# EAGLE design untitled (EAGLE 8.7.0)
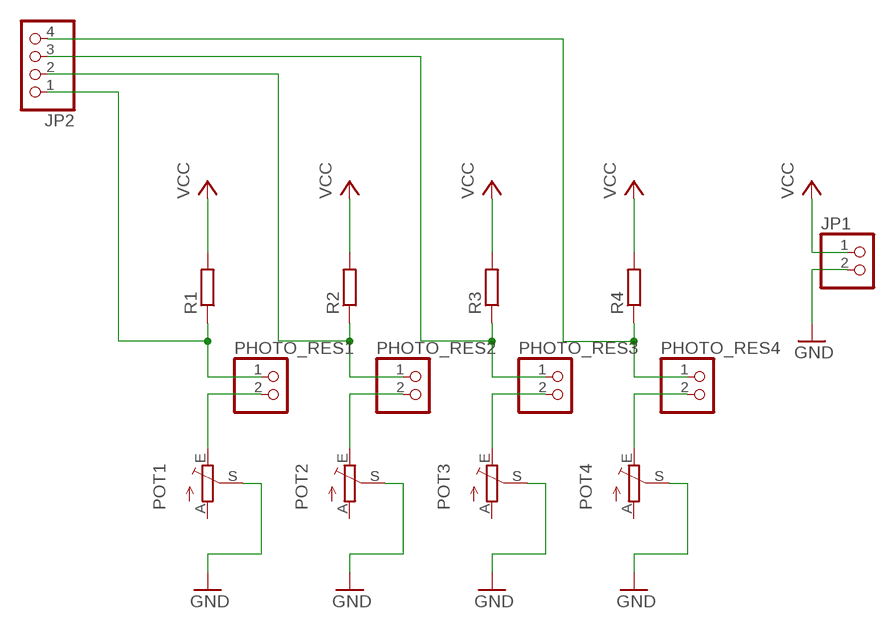
[diagram p0: schematic, sheet 1]

## Parts
JP1  PINHD-1X2  [1X02]
JP2  PINHD-1X4  [1X04]
PHOTO_RES1  PINHD-1X2  [1X02]
PHOTO_RES2  PINHD-1X2  [1X02]
PHOTO_RES3  PINHD-1X2  [1X02]
PHOTO_RES4  PINHD-1X2  [1X02]
POT1  TRIM_EU-RJ9W  [RJ9W]
POT2  TRIM_EU-RJ9W  [RJ9W]
POT3  TRIM_EU-RJ9W  [RJ9W]
POT4  TRIM_EU-RJ9W  [RJ9W]
R1  R-EU_0207/7  [0207/7]
R2  R-EU_0207/7  [0207/7]
R3  R-EU_0207/7  [0207/7]
R4  R-EU_0207/7  [0207/7]

## Nets
GND: JP1.2 POT1.S POT2.S POT3.S POT4.S
N$1: JP2.1 PHOTO_RES1.1 R1.1
N$2: PHOTO_RES1.2 POT1.E
N$3: JP2.2 PHOTO_RES2.1 R2.1
N$4: PHOTO_RES2.2 POT2.E
N$5: JP2.3 PHOTO_RES3.1 R3.1
N$6: PHOTO_RES3.2 POT3.E
N$7: JP2.4 PHOTO_RES4.1 R4.1
N$8: PHOTO_RES4.2 POT4.E
VCC: JP1.1 R1.2 R2.2 R3.2 R4.2
Unconnected: POT1.A POT2.A POT3.A POT4.A

## Library data of the parts
JP1 PHOTO_RES1-PHOTO_RES4 = pinhead:PINHD-1X2: PIN HEADER
JP2 = pinhead:PINHD-1X4: PIN HEADER
POT1-POT4 = pot:TRIM_EU-: POTENTIOMETER
R1-R4 = rcl:R-EU_: RESISTOR, European symbol; SPICEPREFIX: R

## Board
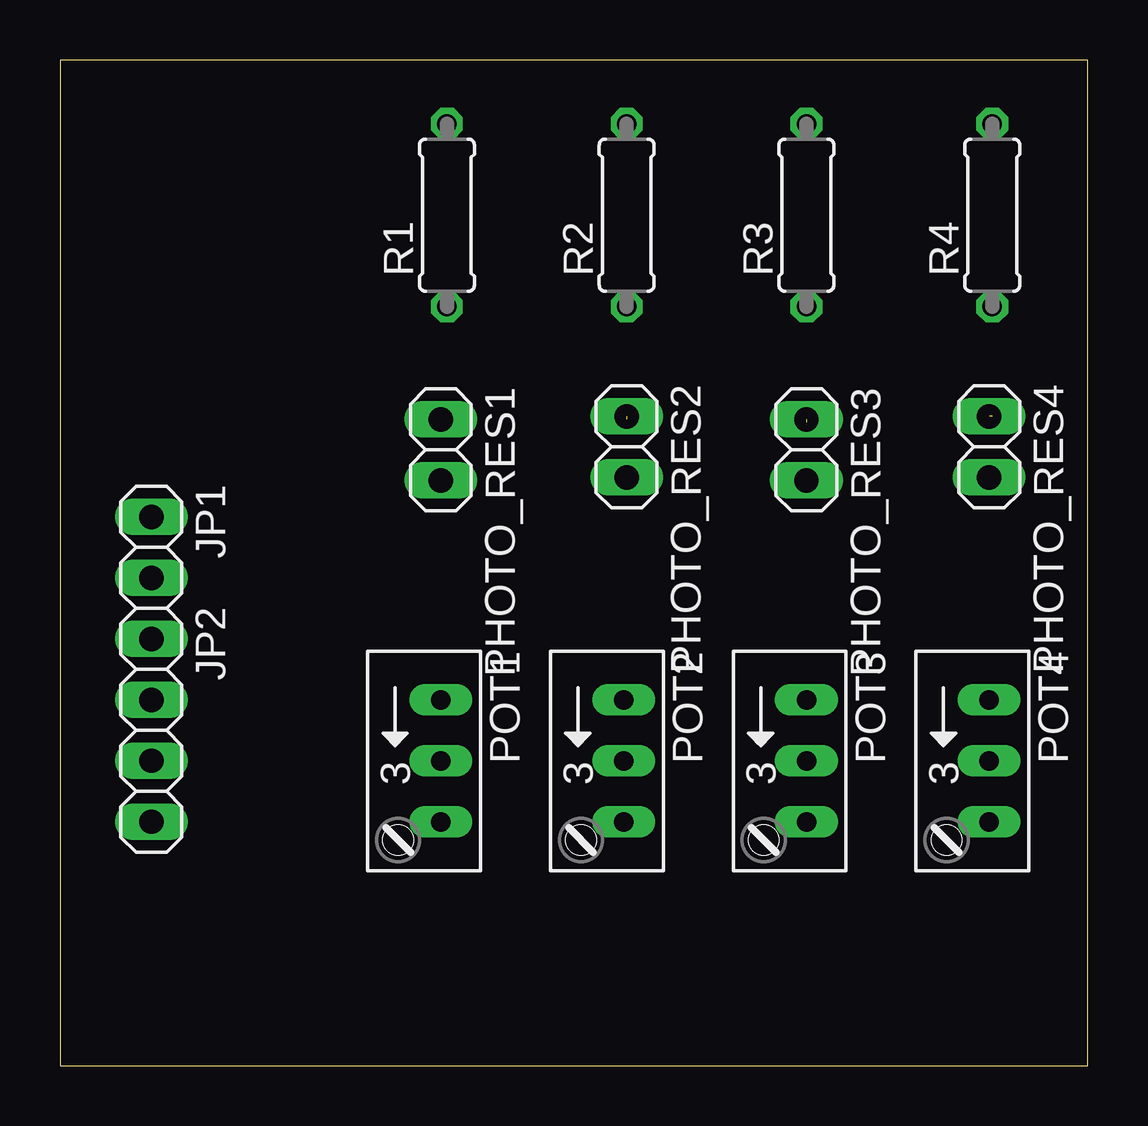
[diagram p1: board, top side]
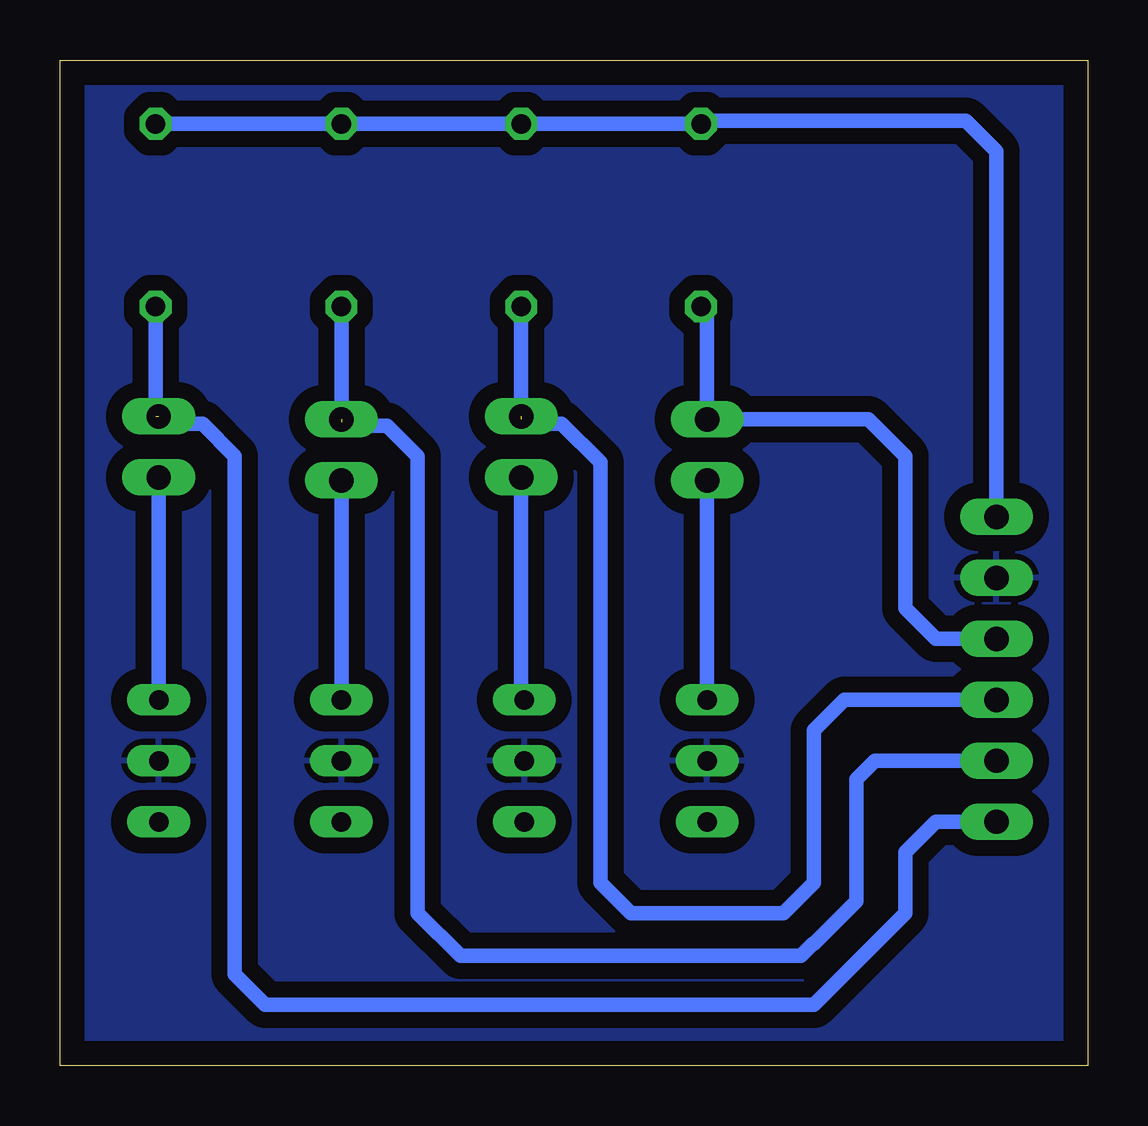
[diagram p2: board, bottom side, seen from below]

Size 42.85 x 41.9 mm. Coordinates in mm from the lower left corner, seen from the top.
Outline: 0,0 42.85,0 42.85,41.9 0,41.9 0,0
Copper layers (1*16): Top 0.035mm / dielectric 1.5mm / Bottom 0.035mm
Design rules "default *": minimum track width 6mil, minimum drill 0.35mm, track to track 26mil, track to pad 26mil, pad to pad 6mil, via to via 6mil, smd to smd 6mil, copper to edge 40mil, drill to drill 6mil, minimum pad ring 10mil, minimum via ring 8mil, stop-mask expansion 4mil, vias tented up to drill 0mil, thermal gap 10mil

### Footprints (pad centres in the part's own frame; a part is rotated, then mirrored left to right if it is on the bottom)
1X02 = drill 1.016 long: 1 -1.27,0; 2 1.27,0
1X04 = drill 1.016 long: 1 -3.81,0; 2 -1.27,0; 3 1.27,0; 4 3.81,0
RJ9W = drill 0.813 long: A 2.54,0.635; E -2.54,0.635; S 0,0.635
0207/7 = drill 0.813 octagon: 1 -3.81,0; 2 3.81,0

### Placement (x,y rotation side)
JP1  3.81,21.59 270 top
JP2  3.81,13.97 270 top
PHOTO_RES1  15.88,25.65 270 top
PHOTO_RES2  23.62,25.78 270 top
PHOTO_RES3  31.11,25.65 270 top
PHOTO_RES4  38.73,25.78 270 top
POT1  15.24,12.7 270 top
POT2  22.86,12.7 270 top
POT3  30.48,12.7 270 top
POT4  38.1,12.7 270 top
R1  16.13,35.43 90 top
R2  23.62,35.43 90 top
R3  31.11,35.43 90 top
R4  38.86,35.43 90 top

### Tracks (layer width: path | path; a pad name or v marks a point on that pad's centre or on a via)
GND
  pour Bottom: -1.27,43.18 -1.27,-1.27 44.45,-1.27 44.45,43.18
N$1
  Bottom 0.61: R1.1 15.88,31.37 PHOTO_RES1.1 9.14,26.92 7.62,25.4 7.62,19.05 6.35,17.78 JP2.1
N$2
  Bottom 0.61: PHOTO_RES1.2 POT1.E
N$3  (1 unrouted)
  Bottom 0.61: R2.1 23.62,26.92 | PHOTO_RES2.1 23.32,26.75 21.93,26.75 20.32,25.13 20.32,7.62 19.05,6.35 12.7,6.35 11.43,7.62 11.43,13.97 10.16,15.24 JP2.2
N$4
  Bottom 0.406: 23.62,15.37 POT2.E
  Bottom 0.61: PHOTO_RES2.2 23.62,15.37
N$5  (1 unrouted)
  Bottom 0.61: R3.1 31.11,26.8 | PHOTO_RES3.1 30.86,26.67 29.21,26.67 27.94,25.4 27.94,6.35 26.16,4.57 11.96,4.57 11.46,5.08 11.43,5.08 9.65,6.86 9.65,11.94 8.89,12.7 JP2.3
N$6
  Bottom 0.61: PHOTO_RES3.2 POT3.E
N$7  (1 unrouted)
  Bottom 0.61: R4.1 38.86,27.05 38.56,26.75 36.91,26.75 35.56,25.4 35.56,3.81 34.29,2.54 11.43,2.54 7.62,6.35 7.62,8.89 6.35,10.16 JP2.4
N$8
  Bottom 0.61: PHOTO_RES4.2 POT4.E
VCC
  Bottom 0.61: JP1.1 3.81,38.1 5.08,39.37 16,39.37 R1.2 R2.2 R3.2 R4.2